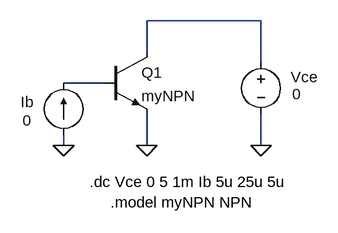
[diagram p0: schematic Fig1_18.asc]
Fig1_18.asc, the LTspice schematic file:
Version 4
SHEET 1 1056 688
WIRE 320 80 144 80
WIRE 144 128 144 80
WIRE 320 144 320 80
WIRE 80 176 16 176
WIRE 16 272 16 256
WIRE 144 272 144 224
WIRE 320 272 320 224
FLAG 144 272 0
FLAG 16 272 0
FLAG 320 272 0
SYMBOL npn 80 128 R0
SYMATTR InstName Q1
SYMATTR Value myNPN
SYMBOL voltage 320 128 R0
WINDOW 0 46 39 Left 0
WINDOW 3 48 65 Left 0
SYMATTR InstName Vce
SYMATTR Value 0
SYMBOL current 16 256 R180
WINDOW 0 46 51 Left 0
WINDOW 3 50 22 Left 0
SYMATTR InstName Ib
SYMATTR Value 0
TEXT 56 328 Left 0 !.dc Vce 0 5 1m Ib 5u 25u 5u
TEXT 88 360 Left 0 !.model myNPN NPN

The netlist it stands for:
* Fig1_18.asc
Q1 N001 N002 0 0 myNPN
Vce N001 0 0
Ib 0 N002 0
.model NPN NPN
.model PNP PNP
.lib standard.bjt
.dc Vce 0 5 1m Ib 5u 25u 5u
.model myNPN NPN
.backanno
.end